# Altium schematic sheet WL-STM.SchDoc: DUC-DDC ТРАНСИВЕР «ВОЛК»
size 594 x 420 mm; Date: 16.10.2020; Author: UA3REO; DrawnBy: 1; Engineer: 1; Organization: 1; DocumentNumber: ТРАНСИВЕР «ВОЛК»; Revision: 1; SheetNumber: 2; SheetTotal: 9; Time: «ВОЛК»; Rule: 16.12.2020; ImagePath: 1
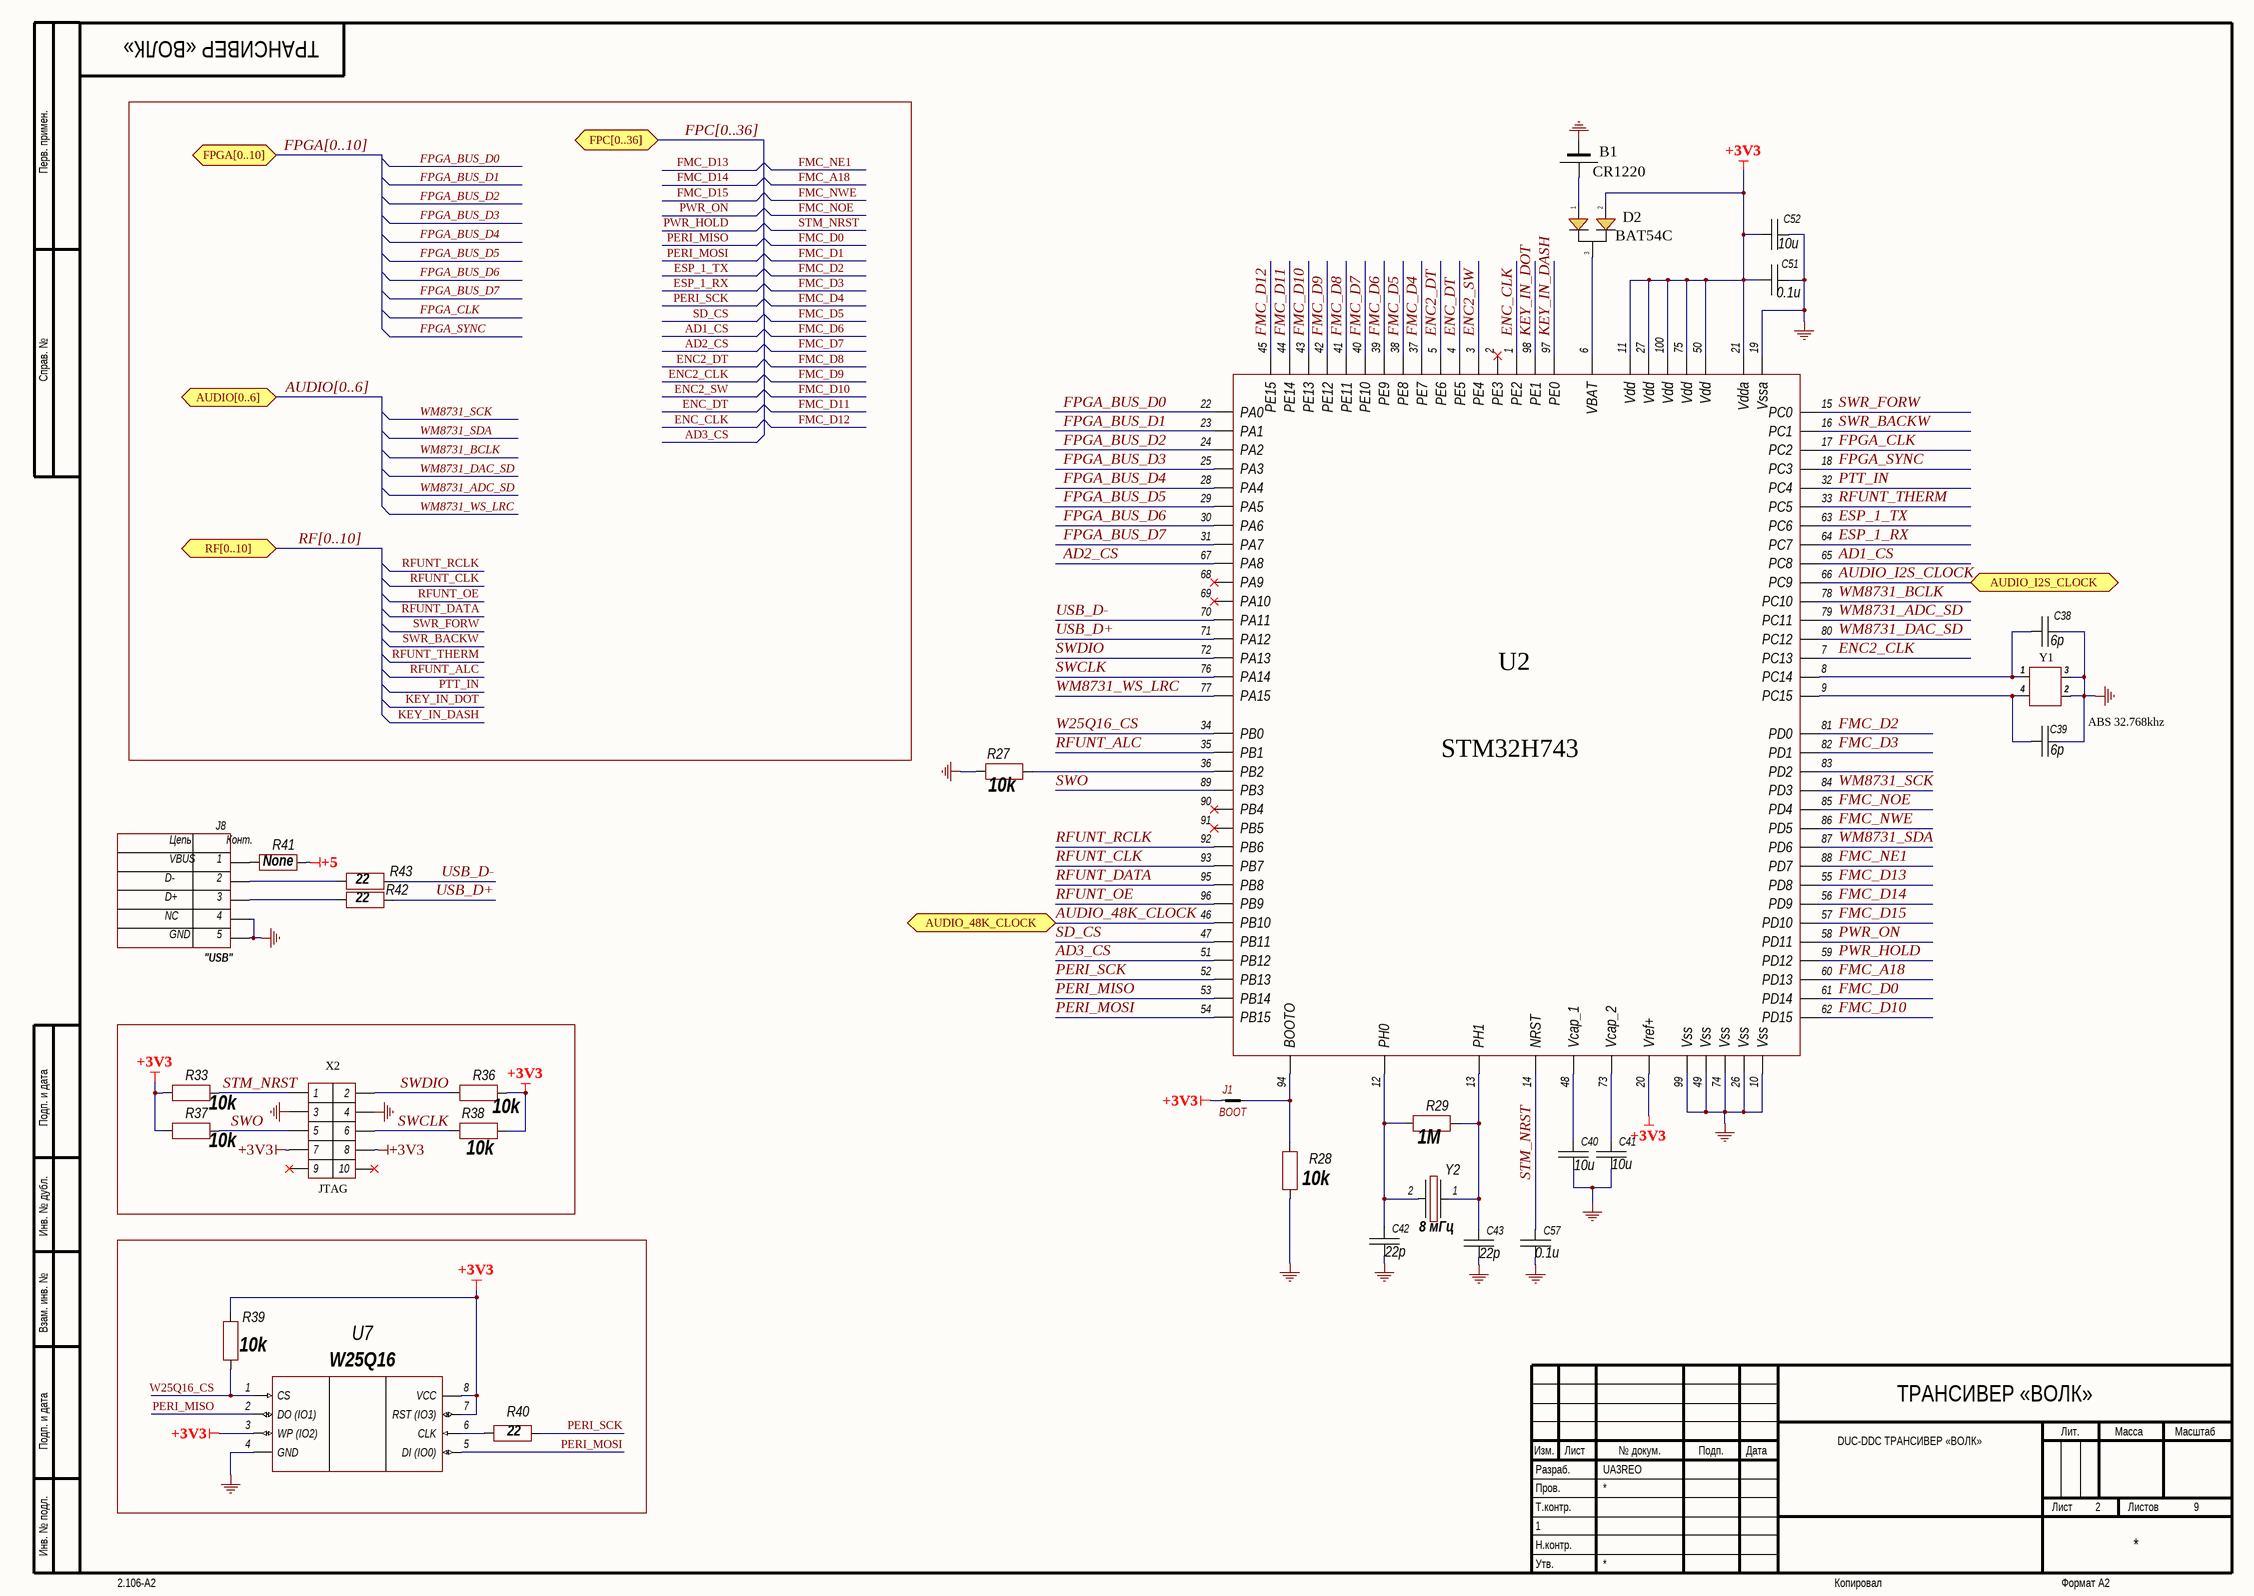
[diagram p0: WL-STM.SchDoc]

## Parts
B1  CR1220  [CR2032]
C38  6p  [CH0805C]
C39  6p  [CH0805C]
C40  10u  [CH0805C]
C41  10u  [CH0805C]
C42  22p  [CH0805C]
C43  22p  [CH0805C]
C51  0.1u  [CH0805C]
C52  10u  [CH0805C]
C57  0.1u  [CH0805C]
D2  BAT54C  [SOT23_132]
J1  BOOT  [CON: PLS-2]
J8  "USB"  [CON: 0675031020]
R27  10k  [CH0805R]
R28  10k  [CH0805R]
R29  1M  [CH0805R]
R33  10k  [CH0805R]
R36  10k  [CH0805R]
R37  10k  [CH0805R]
R38  10k  [CH0805R]
R39  10k  [CH0805R]
R40  22  [CH0805R]
R41  None  [CH0805R]
R42  22  [CH0805R]
R43  22  [CH0805R]
U2  STM32H743  [100-LQFP]
U7  W25Q16  [SOIC-8-1]
X2  JTAG  [CON: PLD-10]
Y1  ABS 32.768khz  [ABS-25]
Y2  8 мГц  [OSC-dip]

## Ports
AUDIO[0..6] (bidir), AUDIO_48K_CLOCK (bidir), AUDIO_I2S_CLOCK (bidir), FPC[0..36] (bidir), FPGA[0..10] (bidir), RF[0..10] (bidir)

## Nets
+3V3: C51.1 C52.1 D2.2 J1.2 R33.2 R36.1 R37.2 R38.1 R39.2 U2.11(Vdd) U2.20(Vref+) U2.21(Vdda) U2.27(Vdd) U2.50(Vdd) U2.75(Vdd) U2.100(Vdd) U7.3(WP_(IO2)) U7.7(RST_(IO3)) U7.8(VCC) X2.7 X2.8
+5: R41.1
GND: B1.2 C38.2 C39.2 C40.1 C41.1 C42.1 C43.1 C51.2 C52.2 C57.1 J8.4 J8.5 R27.2 R28.1 U2.10(Vss) U2.19(Vssa) U2.26(Vss) U2.49(Vss) U2.74(Vss) U2.99(Vss) U7.4(GND) X2.3 X2.4 Y1.2 Y1.3
AD1_CS: U2.65(PC8)
AD2_CS: U2.67(PA8)
AD3_CS: U2.51(PB12)
AUDIO_48K_CLOCK: U2.46(PB10) ; port AUDIO_48K_CLOCK
AUDIO_I2S_CLOCK: U2.66(PC9) ; port AUDIO_I2S_CLOCK
ENC2_CLK: U2.7(PC13)
ENC2_DT: U2.5(PE6)
ENC2_SW: U2.3(PE4)
ENC_CLK: U2.1(PE2)
ENC_DT: U2.4(PE5)
ESP_1_RX: U2.64(PC7)
ESP_1_TX: U2.63(PC6)
FMC_A18: U2.60(PD13)
FMC_D0: U2.61(PD14)
FMC_D2: U2.81(PD0)
FMC_D3: U2.82(PD1)
FMC_D4: U2.37(PE7)
FMC_D5: U2.38(PE8)
FMC_D6: U2.39(PE9)
FMC_D7: U2.40(PE10)
FMC_D8: U2.41(PE11)
FMC_D9: U2.42(PE12)
FMC_D10: U2.43(PE13) U2.62(PD15)
FMC_D11: U2.44(PE14)
FMC_D12: U2.45(PE15)
FMC_D13: U2.55(PD8)
FMC_D14: U2.56(PD9)
FMC_D15: U2.57(PD10)
FMC_NE1: U2.88(PD7)
FMC_NOE: U2.85(PD4)
FMC_NWE: U2.86(PD5)
FPGA_BUS_D0: U2.22(PA0)
FPGA_BUS_D1: U2.23(PA1)
FPGA_BUS_D2: U2.24(PA2)
FPGA_BUS_D3: U2.25(PA3)
FPGA_BUS_D4: U2.28(PA4)
FPGA_BUS_D5: U2.29(PA5)
FPGA_BUS_D6: U2.30(PA6)
FPGA_BUS_D7: U2.31(PA7)
FPGA_CLK: U2.17(PC2)
FPGA_SYNC: U2.18(PC3)
KEY_IN_DASH: U2.97(PE0)
KEY_IN_DOT: U2.98(PE1)
PERI_MISO: U2.53(PB14) U7.2(DO_(IO1))
PERI_MOSI: U2.54(PB15) U7.5(DI_(IO0))
PERI_SCK: R40.2 U2.52(PB13)
PTT_IN: U2.32(PC4)
PWR_HOLD: U2.59(PD12)
PWR_ON: U2.58(PD11)
RFUNT_ALC: U2.35(PB1)
RFUNT_CLK: U2.93(PB7)
RFUNT_DATA: U2.95(PB8)
RFUNT_OE: U2.96(PB9)
RFUNT_RCLK: U2.92(PB6)
RFUNT_THERM: U2.33(PC5)
SD_CS: U2.47(PB11)
STM_NRST: C57.2 U2.14(NRST)
SWCLK: R38.2 U2.76(PA14) X2.6
SWDIO: R36.2 U2.72(PA13) X2.2
SWO: R37.1 U2.89(PB3) X2.5
SWR_BACKW: U2.16(PC1)
SWR_FORW: U2.15(PC0)
USB_D+: R42.1 U2.71(PA12)
USB_D-: R43.1 U2.70(PA11)
W25Q16_CS: R39.1 U2.34(PB0) U7.1(CS)
WM8731_ADC_SD: U2.79(PC11)
WM8731_BCLK: U2.78(PC10)
WM8731_DAC_SD: U2.80(PC12)
WM8731_SCK: U2.84(PD3)
WM8731_SDA: U2.87(PD6)
WM8731_WS_LRC: U2.77(PA15)
NetB1_1: B1.1 D2.1
NetC38_1: C38.1 U2.8(PC14) Y1.1
NetC39_1: C39.1 U2.9(PC15) Y1.4
NetC40_2: C40.2 U2.48(Vcap_1)
NetC41_2: C41.2 U2.73(Vcap_2)
NetC42_2: C42.2 R29.2 U2.12(PH0) Y2.2
NetC43_2: C43.2 R29.1 U2.13(PH1) Y2.1
NetD2_3: D2.3 U2.6(VBAT)
NetJ1_1: J1.1 R28.2 U2.94(BOOTO)
NetJ8_1: J8.1 R41.2
NetJ8_2: J8.2 R43.2
NetJ8_3: J8.3 R42.2
NetR27_1: R27.1 U2.36(PB2)
NetR33_1: R33.1 X2.1
NetR40_1: R40.1 U7.6(CLK)

Not connected (* = marked no-connect by the designer): U2 2(PE3)* 68(PA9)* 69(PA10)* 83(PD2) 90(PB4)* 91(PB5)*; X2 9* 10*

## Buses and harness runs
bus AUDIO[0..6] = port AUDIO[0..6]
bus FPC[0..36] = port FPC[0..36]
bus FPGA[0..10] = port FPGA[0..10]
bus RF[0..10] = port RF[0..10]

## Notes on the sheet
- Labels drawn without touching a wire or pin: STM_NRST
- Перв. примен.
- Справ. №
- Подп. и дата
- Инв. № дубл.
- Взам. инв. №
- Разраб.
- Изм.
- Лист
- № докум.
- Подп.
- Дата
- Лит.
- Масса
- Масштаб
- Пров.
- Т.контр.
- Листов
- Инв. № подл.
- Утв.
- Н.контр.
- 2.106-A2
- Копировал
- Формат А2
- (in symbol miniUSB-B) Цепь; Конт.; VBUS; D-; D+; NC; GND

## Library data of the parts
B1 = POWER_BAT
C38-C43 C51 C52 C57 = Capacitor: Manufacturer: *; Model: *; HelpURL: *; ComponentKind: *; Value: *
J1 = DJAMPER
J8 = miniUSB-B: USB; Manufacturer: *; Model: *; HelpURL: *; ComponentKind: *
R27-R29 R33 R36-R43 = Resistor: Manufacturer: *; Model: *; HelpURL: *; ComponentKind: *; Value: *
U7 = W25Q32JVZPIQ: Flash; Manufacturer: Winbond Electronics; Model: W25Q32JVZPIQ; HelpURL: https://www.digikey.com/product-detail/en/winbond-electronics/W25Q32JVZPIQ/W25Q32JVZPIQ-ND/6167525; ComponentKind: 8-WSON
Y1 = ABS25
Y2 = Oscillator: Manufacturer: *; Model: *; HelpURL: *; ComponentKind: *; Value: *